# Altium schematic sheet sensor.SchDoc
size A4
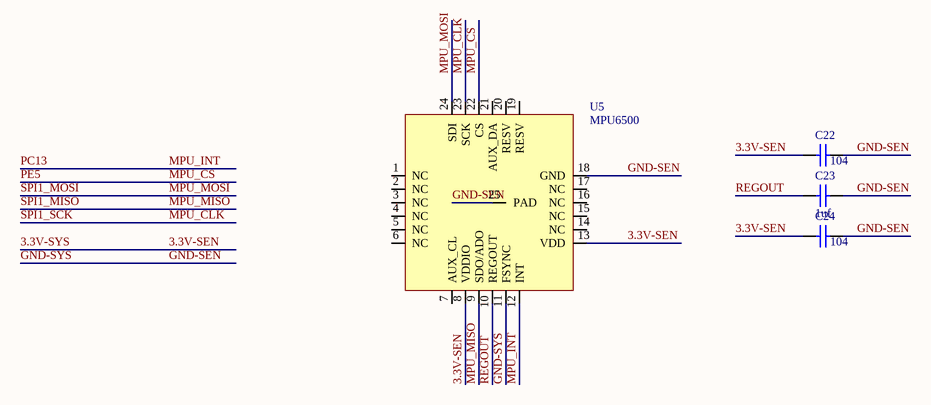
[diagram p0: sensor.SchDoc]

## Parts
C22  value 104  [C0402]  (hidden comment: Cap)
C23  value 1uf  [C0402]  (hidden comment: Cap)
C24  value 104  [C0402]  (hidden comment: Cap)
U5  MPU6500  [MPU6500-QFN24]

## Nets
3.3V-SEN: C22.2 C24.2 U5.8(VDDIO) U5.13(VDD)  [also labelled 3.3V-SYS]
GND-SEN: C22.1 C23.1 C24.1 U5.11(FSYNC) U5.18(GND) U5.25(PAD)  [also labelled GND-SYS]
MPU_CLK: U5.23(SCK)  [also labelled SPI1_SCK]
MPU_CS: U5.22(CS)  [also labelled PE5]
MPU_INT: U5.12(INT)  [also labelled PC13]
MPU_MISO: U5.9(SDO/ADO)  [also labelled SPI1_MISO]
MPU_MOSI: U5.24(SDI)  [also labelled SPI1_MOSI]
REGOUT: C23.2 U5.10(REGOUT)

Not connected (* = marked no-connect by the designer): U5 1(NC) 2(NC) 3(NC) 4(NC) 5(NC) 6(NC) 7(AUX_CL) 14(NC) 15(NC) 16(NC) 17(NC) 19(RESV) 20(RESV) 21(AUX_DA)

## Library data of the parts
C22-C24 = Cap: Capacitor; Published: 8-Jun-2000; LatestRevisionDate: 17-Jul-2002; LatestRevisionNote: Re-released for DXP Platform.; PackageReference: RAD-0.3; Publisher: Altium Limited